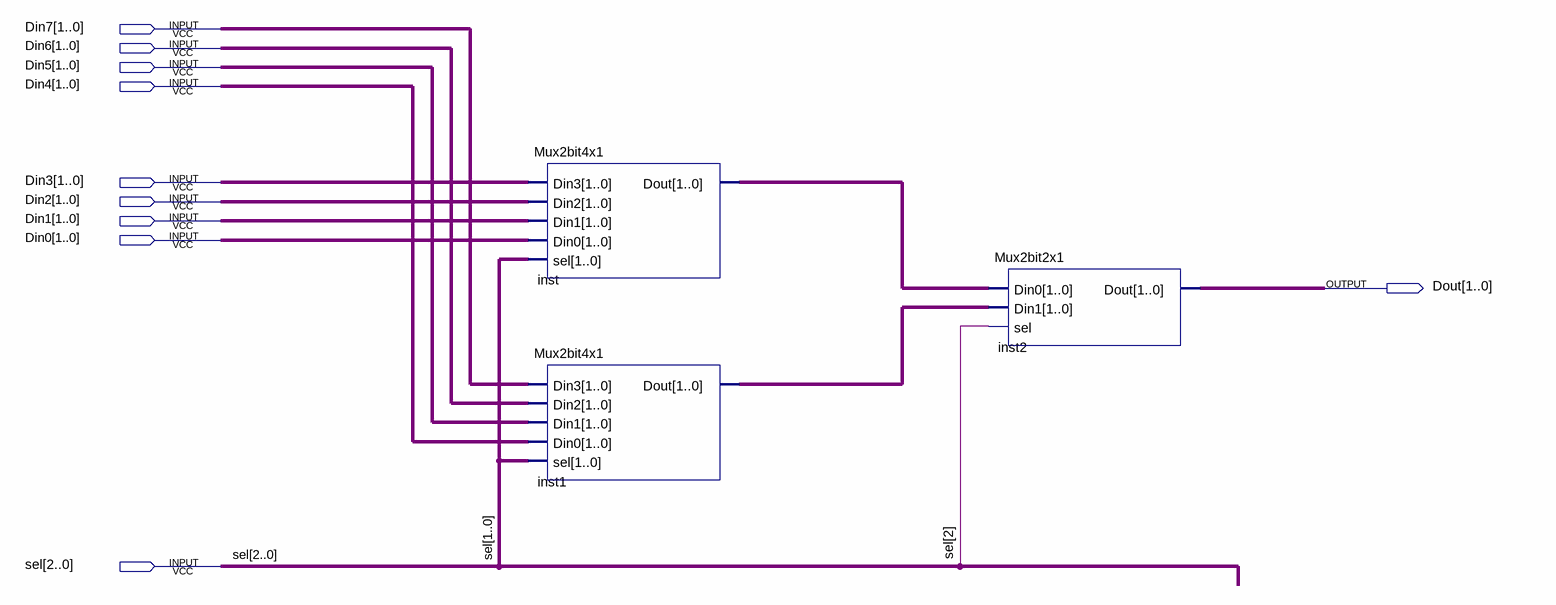
[diagram p0: schematic sheet]
// Quartus schematic Mux2bit8x1.bdf as structural Verilog: 3 symbols, 10 pins
module Mux2bit8x1 (
  input  [1:0] Din7,
  input  [1:0] Din6,
  input  [1:0] Din5,
  input  [1:0] Din4,
  input  [1:0] Din3,
  input  [1:0] Din2,
  input  [1:0] Din1,
  input  [1:0] Din0,
  input  [2:0] sel,
  output [1:0] Dout
);

  wire [1:0] inst1_dout, inst_dout;

  Mux2bit4x1 inst (.Din3(Din3), .Din2(Din2), .Din1(Din1), .Din0(Din0), .sel(sel[1:0]), .Dout(inst_dout));
  Mux2bit4x1 inst1 (.Din3(Din7), .Din2(Din6), .Din1(Din5), .Din0(Din4), .sel(sel[1:0]), .Dout(inst1_dout));
  Mux2bit2x1 inst2 (.Din0(inst_dout), .Din1(inst1_dout), .sel(sel[2]), .Dout(Dout));
endmodule
